# Altium schematic sheet Block Diagram.SchDoc: Block Diagram
size A4; Date: Dec. 28th, 2022; Author: Karl Asseily; DrawnBy: Karl Asseily; DocumentNumber: 202301152243; Revision: 1.2; SheetNumber: 2; SheetTotal: 20
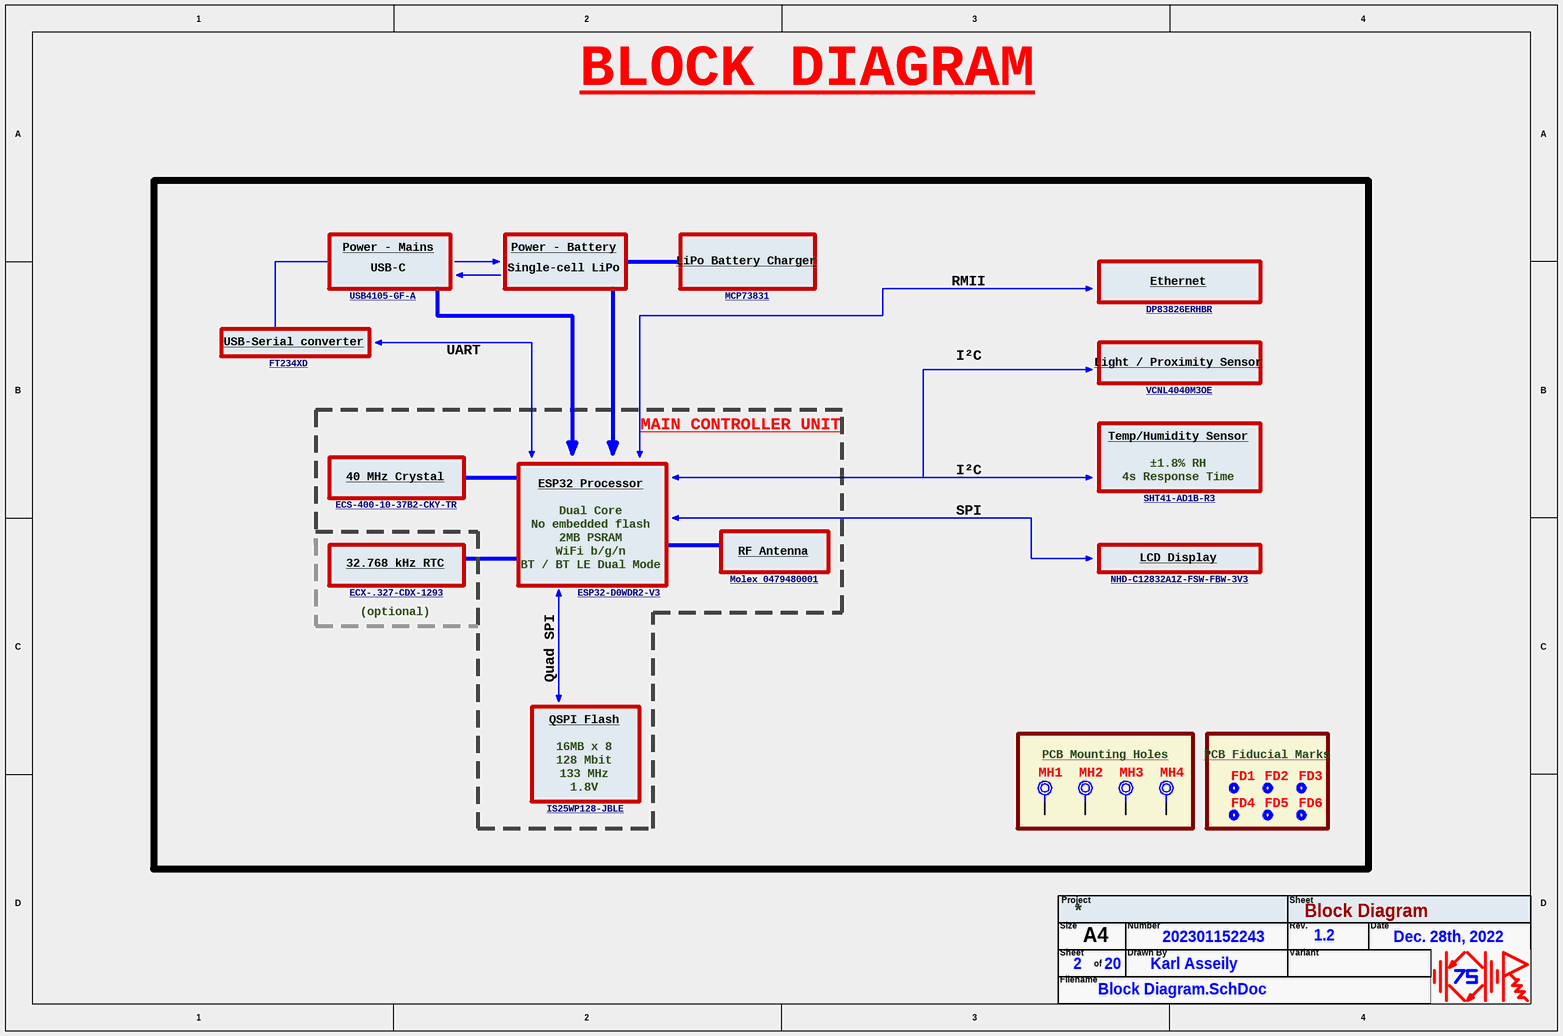
[diagram p0: Block Diagram.SchDoc]

## Parts
FD1  Fiducial  [FID_SQ]  (value not drawn)  (no BOM)
FD2  Fiducial  [FID_RD]  (value not drawn)  (no BOM)
FD3  Fiducial  [FID_RD]  (value not drawn)  (no BOM)
FD4  Fiducial  [FID_SQ]  (value not drawn)  (no BOM)
FD5  Fiducial  [FID_RD]  (value not drawn)  (no BOM)
FD6  Fiducial  [FID_RD]  (value not drawn)  (no BOM)
MH1  Plated Through-Hole  [PTH_3.5MM]  (value not drawn)  (no BOM)
MH2  Plated Through-Hole  [PTH_3.5MM]  (value not drawn)  (no BOM)
MH3  Plated Through-Hole  [PTH_3.5MM]  (value not drawn)  (no BOM)
MH4  Plated Through-Hole  [PTH_3.5MM]  (value not drawn)  (no BOM)

## Blocks framed on the sheet
PCB Mounting Holes: MH1-MH4
PCB Fiducial Marks: FD1-FD6

## Nets

Not connected (* = marked no-connect by the designer): MH1 1; MH2 1; MH3 1; MH4 1

## Notes on the sheet
- BLOCK DIAGRAM
- Power - Mains
- Power - Battery
- USB4105-GF-A <https://www.digikey.com/en/products/detail/gct/USB4105-GF-A/11198441>
- USB-C
- Single-cell LiPo
- LiPo Battery Charger
- MCP73831 <https://www.digikey.com/en/products/detail/microchip-technology/MCP73831T-2ATI-MC/964302>
- RMII
- Ethernet
- DP83826ERHBR <https://www.digikey.com/en/products/detail/texas-instruments/DP83826ERHBR/11502202>
- FT234XD <https://www.digikey.com/en/products/detail/ftdi-future-technology-devices-international-ltd/FT234XD-T/3904810>
- USB-Serial converter
- UART
- I²C
- Light / Proximity Sensor
- VCNL4040M3OE <https://www.digikey.com/en/products/detail/vishay-semiconductor-opto-division/VCNL4040M3OE/5171283>
- MAIN CONTROLLER UNIT
- Temp/Humidity Sensor
- 40 MHz Crystal
- ECS-400-10-37B2-CKY-TR <https://www.digikey.com/en/products/detail/ecs-inc/ECS-400-10-37B2-CKY-TR/14548829>
- Dual Core
- ESP32 Processor
- No embedded flash
- SPI
- ±1.8% RH
- 4s Response Time
- SHT41-AD1B-R3 <https://www.digikey.com/en/products/detail/sensirion-ag/SHT41-AD1B-R3/15296592>
- 32.768 kHz RTC
- BT / BT LE Dual Mode
- 2MB PSRAM
- WiFi b/g/n
- RF Antenna
- Molex 0479480001 <https://www.digikey.com/en/products/detail/molex/0479480001/2683663>
- LCD Display
- NHD-C12832A1Z-FSW-FBW-3V3 <https://www.digikey.com/en/products/detail/newhaven-display-intl/NHD-C12832A1Z-FSW-FBW-3V3/2059236?s=N4IgTCBcDaIHYAsAmBaAxgRjADgMxgEMMAvFAMwGcB3cgIxtwDdcQBdAXyA>
- (optional)
- ECX-.327-CDX-1293 <https://www.digikey.com/en/products/detail/ecs-inc/ECX-327-CDX-1293/6821612?s=N4IgjCBcpgbFoDGUBmBDANgZwKYBoQB7KAbXFgA5ZYBOEAXQIAcAXKEAZRYCcBLAOwDmIAL4FaCEMkjps%2BIqRAAWAAw0AzBobM2kTjwHCxIAKzqA7JOmzcBYpDIAmWEsuMQrdlz5DRBMDQUdNBSqJi2Cg4gKgzGjmAmMSHW4fL2ZOqOAHTmlAAEANYAEgBe2h66IACq-LwsAPIoALI4aFgArtw4fiAAtI5WUDztaYomsQS98MlD3CN2iuogBErLIAP0xr3BSLPzkWQQm5MQMzKpC1GJscbToLwAJuy9YCoQOuxrLACeTN16bWQIhEQA>
- Quad SPI
- ESP32-D0WDR2-V3 <https://www.digikey.com/en/products/detail/espressif-systems/ESP32-D0WDR2-V3/16677213>
- QSPI Flash
- 16MB x 8
- 128 Mbit
- 133 MHz
- 1.8V
- IS25WP128-JBLE <https://www.digikey.com/en/products/detail/issi-integrated-silicon-solution-inc/IS25WP128-JBLE/5431600>
- Project
- Sheet
- Size
- Filename
- A4
- of
- Number
- Drawn By
- Rev.
- Variant
- Date

## Library data of the parts
FD1-FD6 = Fiducial Mark: PCB Fiducial Mark
MH1-MH4 = MH_3.5H_6D: Hole Plated 3.5mm ID / 6mm OD